# Altium schematic sheet [04] - MAIN.SchDoc
size A4
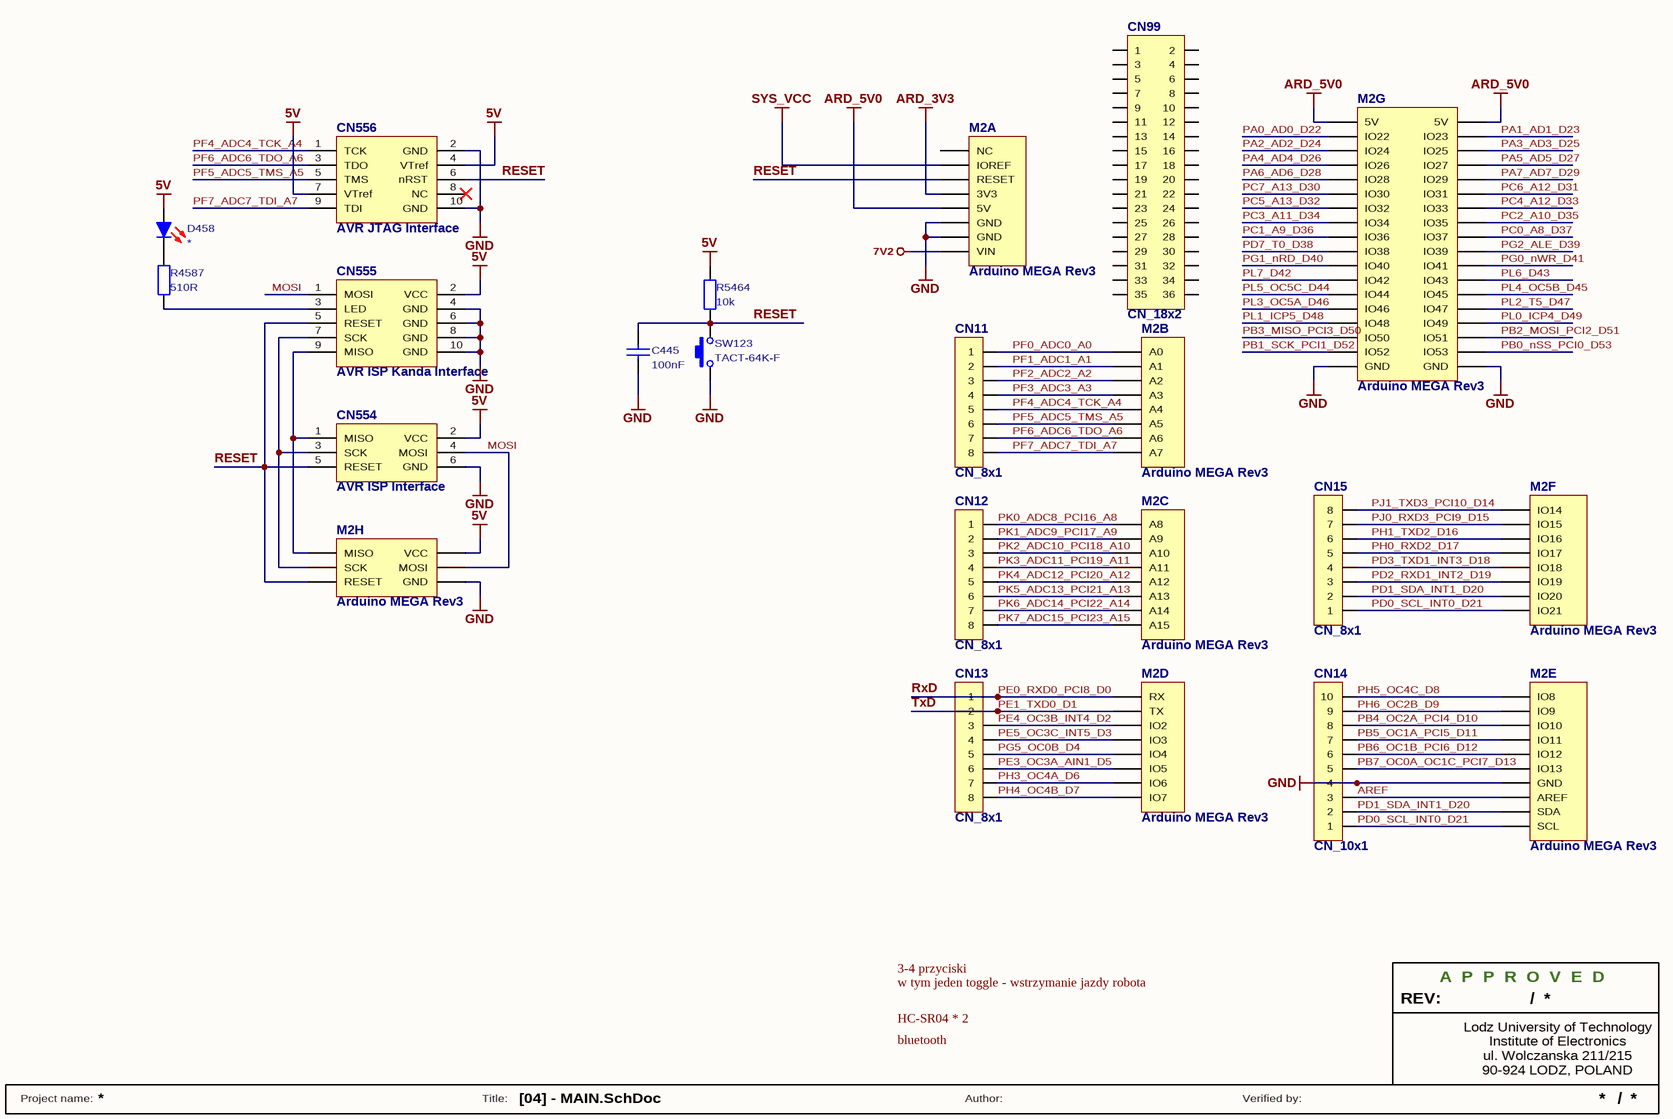
[diagram p0: [04] - MAIN.SchDoc]

## Parts
C445  100nF  [C1206]
CN11  CN_8x1  [GP_8x1]
CN12  CN_8x1  [GP_8x1]
CN13  CN_8x1  [GP_8x1]
CN14  CN_10x1  [GP_10x1]
CN15  CN_8x1  [GP_8x1]
CN99  CN_18x2  [GP_18x2]
CN554  AVR ISP Interface  [IDC6]
CN555  AVR ISP Kanda Interface  [IDC10]
CN556  AVR JTAG Interface  [IDC10]
D458  *  [LED1206R]
M2  Arduino MEGA Rev3  [Arduino_MEGA_UPSIDE_DOWN]  (parts A,B,C,D,E,F,G,H of 8)
R4587  510R  [R1206]
R5464  10k  [R1206]
SW123  TACT-64K-F  [TACT-64K-F]

## Nets
5V: CN554.2(VCC) CN555.2(VCC) CN556.4(VTref) CN556.7(VTref) D458.1(A) M2.PROG2(VCC) R5464.2
7V2: M2.P8(VIN)
ARD_3V3: M2.P4(3V3)
ARD_5V0: M2.D26(5V) M2.D27(5V) M2.P5(5V)
GND: C445.1 CN14.4 CN554.6(GND) CN555.4(GND) CN555.6(GND) CN555.8(GND) CN555.10(GND) CN556.2(GND) CN556.10(GND) M2.D14(GND) M2.D60(GND) M2.D61(GND) M2.P6(GND) M2.P7(GND) M2.PROG6(GND) SW123.1
SYS_VCC: M2.P2(IOREF)
AREF: CN14.3 M2.D15(AREF)
MOSI: CN554.4(MOSI) CN555.1(MOSI) M2.PROG4(MOSI)
PA0_AD0_D22: M2.D28(IO22)
PA1_AD1_D23: M2.D29(IO23)
PA2_AD2_D24: M2.D30(IO24)
PA3_AD3_D25: M2.D31(IO25)
PA4_AD4_D26: M2.D32(IO26)
PA5_AD5_D27: M2.D33(IO27)
PA6_AD6_D28: M2.D34(IO28)
PA7_AD7_D29: M2.D35(IO29)
PB0_nSS_PCI0_D53: M2.D59(IO53)
PB1_SCK_PCI1_D52: M2.D58(IO52)
PB2_MOSI_PCI2_D51: M2.D57(IO51)
PB3_MISO_PCI3_D50: M2.D56(IO50)
PB4_OC2A_PCI4_D10: CN14.8 M2.D10(IO10)
PB5_OC1A_PCI5_D11: CN14.7 M2.D11(IO11)
PB6_OC1B_PCI6_D12: CN14.6 M2.D12(IO12)
PB7_OC0A_OC1C_PCI7_D13: CN14.5 M2.D13(IO13)
PC0_A8_D37: M2.D43(IO37)
PC1_A9_D36: M2.D42(IO36)
PC2_A10_D35: M2.D41(IO35)
PC3_A11_D34: M2.D40(IO34)
PC4_A12_D33: M2.D39(IO33)
PC5_A13_D32: M2.D38(IO32)
PC6_A12_D31: M2.D37(IO31)
PC7_A13_D30: M2.D36(IO30)
PD0_SCL_INT0_D21: CN14.1 CN15.1 M2.D17(SCL) M2.D25(IO21)
PD1_SDA_INT1_D20: CN14.2 CN15.2 M2.D16(SDA) M2.D24(IO20)
PD2_RXD1_INT2_D19: CN15.3 M2.D23(IO19)
PD3_TXD1_INT3_D18: CN15.4 M2.D22(IO18)
PD7_T0_D38: M2.D44(IO38)
PE0_RXD0_PCI8_D0: CN13.1 M2.D0(RX)  [also labelled RxD]
PE1_TXD0_D1: CN13.2 M2.D1(TX)  [also labelled TxD]
PE3_OC3A_AIN1_D5: CN13.6 M2.D5(IO5)
PE4_OC3B_INT4_D2: CN13.3 M2.D2(IO2)
PE5_OC3C_INT5_D3: CN13.4 M2.D3(IO3)
PF0_ADC0_A0: CN11.1 M2.A0
PF1_ADC1_A1: CN11.2 M2.A1
PF2_ADC2_A2: CN11.3 M2.A2
PF3_ADC3_A3: CN11.4 M2.A3
PF4_ADC4_TCK_A4: CN11.5 CN556.1(TCK) M2.A4
PF5_ADC5_TMS_A5: CN11.6 CN556.5(TMS) M2.A5
PF6_ADC6_TDO_A6: CN11.7 CN556.3(TDO) M2.A6
PF7_ADC7_TDI_A7: CN11.8 CN556.9(TDI) M2.A7
PG0_nWR_D41: M2.D47(IO41)
PG1_nRD_D40: M2.D46(IO40)
PG2_ALE_D39: M2.D45(IO39)
PG5_OC0B_D4: CN13.5 M2.D4(IO4)
PH0_RXD2_D17: CN15.5 M2.D21(IO17)
PH1_TXD2_D16: CN15.6 M2.D20(IO16)
PH3_OC4A_D6: CN13.7 M2.D6(IO6)
PH4_OC4B_D7: CN13.8 M2.D7(IO7)
PH5_OC4C_D8: CN14.10 M2.D8(IO8)
PH6_OC2B_D9: CN14.9 M2.D9(IO9)
PJ0_RXD3_PCI9_D15: CN15.7 M2.D19(IO15)
PJ1_TXD3_PCI10_D14: CN15.8 M2.D18(IO14)
PK0_ADC8_PCI16_A8: CN12.1 M2.A8
PK1_ADC9_PCI17_A9: CN12.2 M2.A9
PK2_ADC10_PCI18_A10: CN12.3 M2.A10
PK3_ADC11_PCI19_A11: CN12.4 M2.A11
PK4_ADC12_PCI20_A12: CN12.5 M2.A12
PK5_ADC13_PCI21_A13: CN12.6 M2.A13
PK6_ADC14_PCI22_A14: CN12.7 M2.A14
PK7_ADC15_PCI23_A15: CN12.8 M2.A15
PL0_ICP4_D49: M2.D55(IO49)
PL1_ICP5_D48: M2.D54(IO48)
PL2_T5_D47: M2.D53(IO47)
PL3_OC5A_D46: M2.D52(IO46)
PL4_OC5B_D45: M2.D51(IO45)
PL5_OC5C_D44: M2.D50(IO44)
PL6_D43: M2.D49(IO43)
PL7_D42: M2.D48(IO42)
RESET: C445.2 CN554.5(RESET) CN555.5(RESET) CN556.6(nRST) M2.P3(RESET) M2.PROG5(RESET) R5464.1 SW123.2
NetCN554_1: CN554.1(MISO) CN555.9(MISO) M2.PROG1(MISO)
NetCN554_3: CN554.3(SCK) CN555.7(SCK) M2.PROG3(SCK)
NetCN555_3: CN555.3(LED) R4587.1
NetD458_2: D458.2(K) R4587.2

Not connected (* = marked no-connect by the designer): CN99 1 2 3 4 5 6 7 8 9 10 11 12 13 14 15 16 17 18 19 20 21 22 23 24 25 26 27 28 29 30 31 32 33 34 35 36; CN556 8(NC)*; M2 P1(NC)

## Notes on the sheet
- Labels drawn without touching a wire or pin: 3-4 przyciski, bluetooth, HC-SR04 * 2, w tym jeden toggle - wstrzymanie jazdy robota
- REV:
- A  P  P  R  O  V  E  D
- /
- Lodz University of Technology
- ul. Wolczanska 211/215
- 90-924 LODZ, POLAND
- Institute of Electronics
- Project name:
- Title:
- Author:
- Verified by:

## Library data of the parts
C445 = Cap: Capacitor; ComponentLink1Description: datasheet; ComponentLink2Description: supplier; Value: 100nF
CN554 = AVR ISP Interface: ISP Programming Header for AVR MCU's
CN555 = AVR ISP Kanda Interface: Kanda ISP Programming Header for AVR MCU's
CN556 = AVR JTAG Interface: JTAG Header for AVR MCU's
D458 = LED_RED: RED LED; Published: 04-Apr-2006
M2 = Arduino MEGA Rev3: Arduino MEGA Rev3 Board
R4587 = Res: Resistor; Value: 4k7; Published: 19-Feb-2006; ComponentLink1Description: datasheet; ComponentLink2Description: supplier
R5464 = Res: Resistor; Published: 19-Feb-2006; ComponentLink1Description: datasheet; ComponentLink2Description: supplier; Value: 10k
SW123 = TACT-64K-F: 6x6mm THT Tactile SPST-NO Switch; Published: 30-Jun-2006